# Altium project V9_BMU_REV43.PrjPcb (part 2 of 3)

## Sheet PG10_ MCU.SchDoc: BMU - MCU Circuit
size B; Address1: 3511 EDISON WAY; Address2: MENLO PARK, CA, 94025; DocumentNumber: 1; Revision: 4.1; SheetNumber: 5; SheetTotal: 9
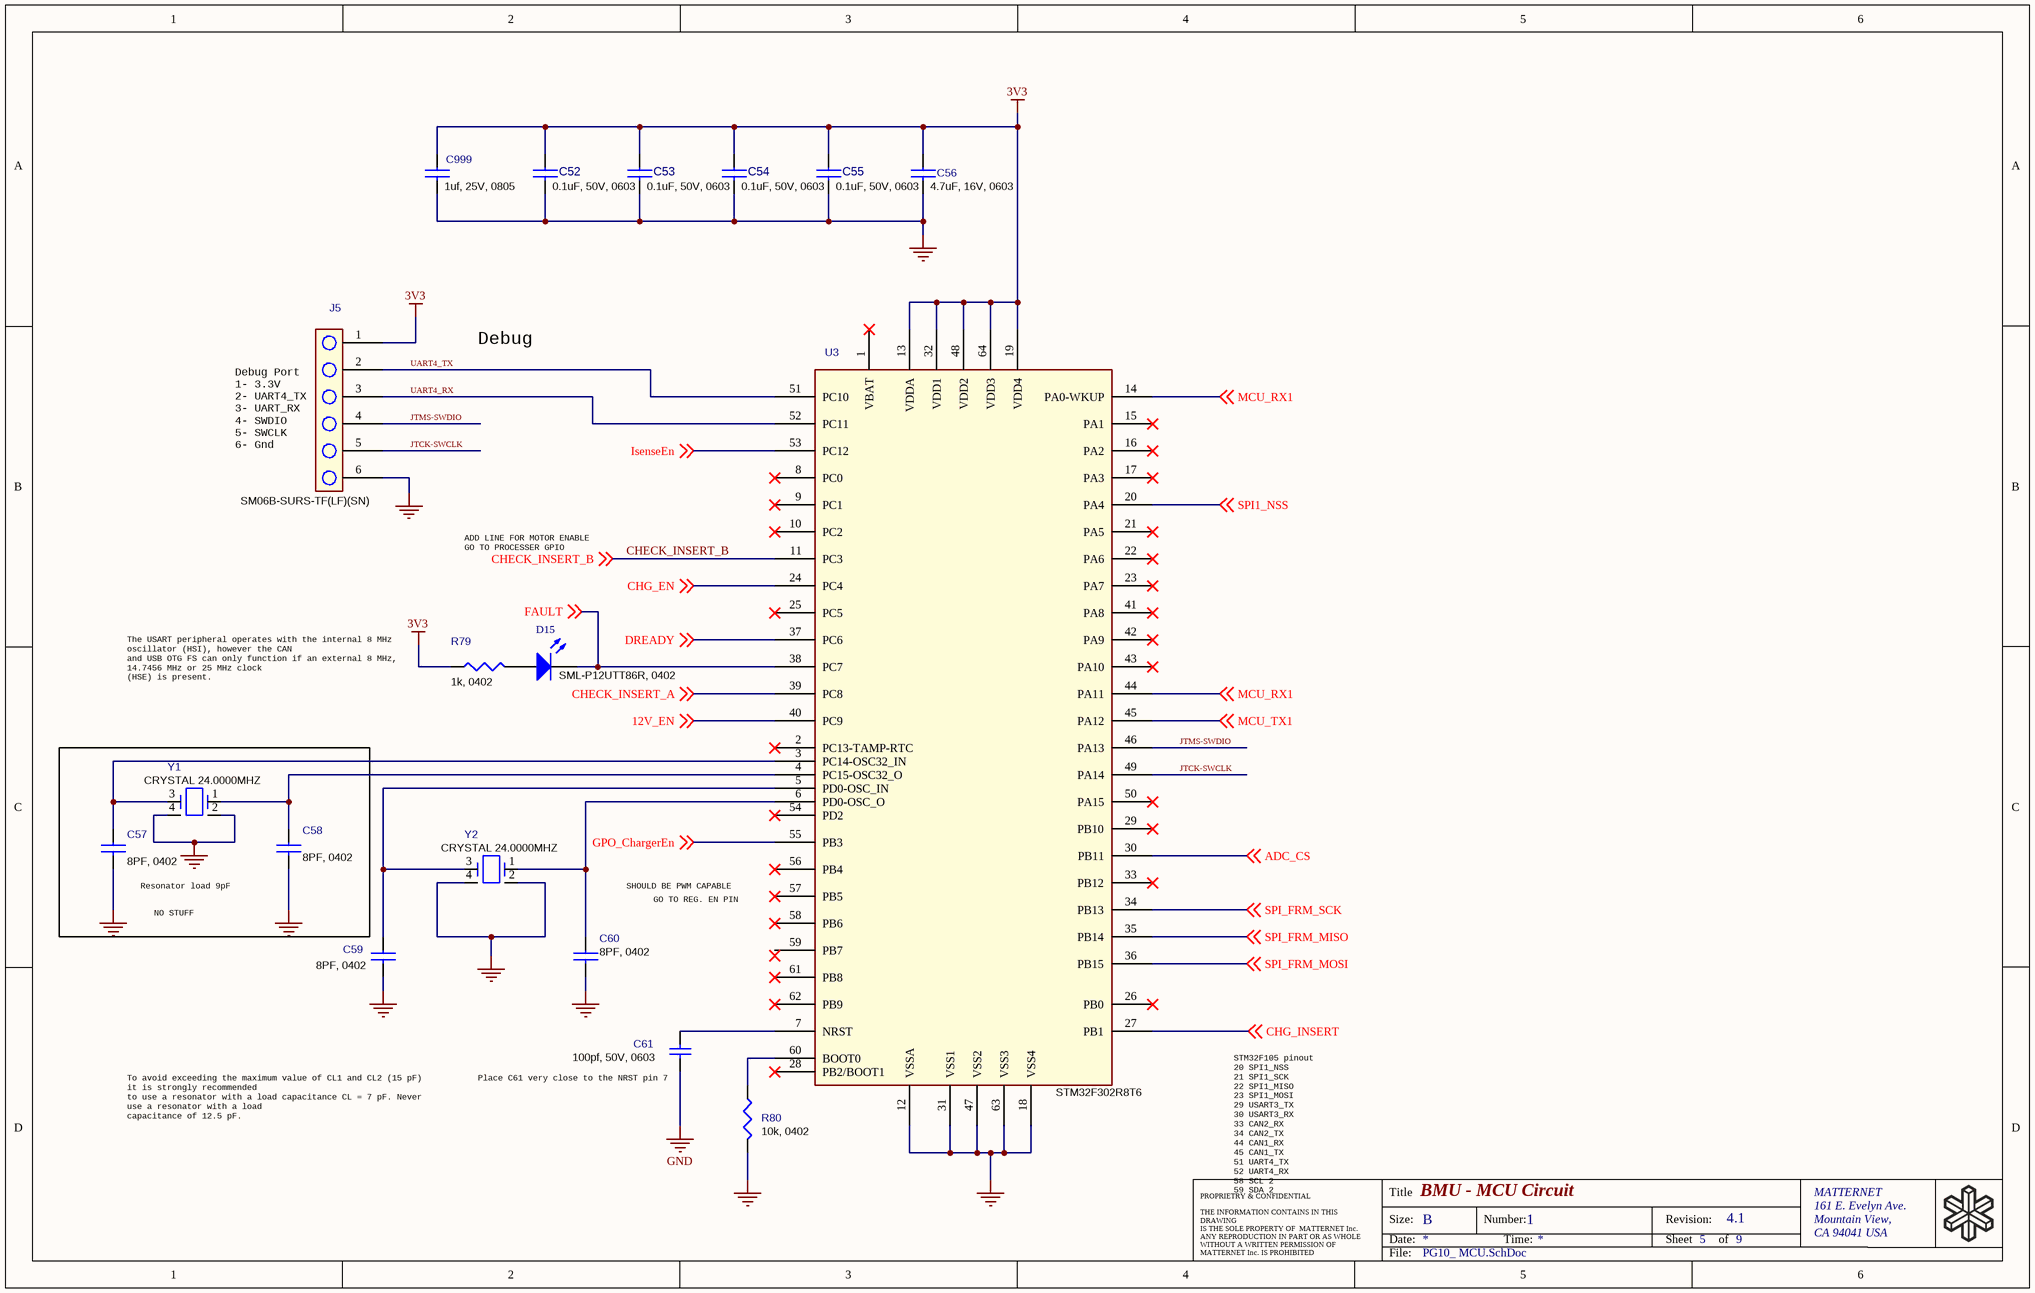
[diagram p4: PG10_ MCU.SchDoc]

### Parts
C52  0.1uF, 50V, 0603  [C0603]
C53  0.1uF, 50V, 0603  [C0603]
C54  0.1uF, 50V, 0603  [C0603]
C55  0.1uF, 50V, 0603  [C0603]
C56  4.7uF, 16V, 0603  [C0805]
C57  8PF, 0402  [C0402]
C58  8PF, 0402  [C0402]
C59  8PF, 0402  [C0402]
C60  8PF, 0402  [C0402]
C61  100pf, 50V, 0603  [C0603]
C999  1uf, 25V, 0805  [C0805]
D15  SML-P12UTT86R, 0402  [D0402_1]
J5  SM06B-SURS-TF(LF)(SN)  [0.8mm]
R79  1k, 0402  [R0402]
R80  10k, 0402  [R0402]
U3  STM32F302R8T6  [64LQFP]
Y1  CRYSTAL 24.0000MHZ  [CRYSTAL_NX3225SA]
Y2  CRYSTAL 24.0000MHZ  [CRYSTAL_NX3225SA]

### Nets
3V3: C52.1 C53.1 C54.1 C55.1 C56.1 C999.1 J5.1 R79.1 U3.13(VDDA) U3.19(VDD4) U3.32(VDD1) U3.48(VDD2) U3.64(VDD3)
GND: C52.2 C53.2 C54.2 C55.2 C56.2 C57.2 C58.2 C59.2 C60.2 C61.1 C999.2 J5.6 R80.2 U3.12(VSSA) U3.18(VSS4) U3.31(VSS1) U3.47(VSS2) U3.63(VSS3) Y1.2 Y1.4 Y2.2 Y2.4
12V_EN: U3.40(PC9) ; off-sheet 12V_EN
ADC_CS: U3.30(PB11) ; off-sheet ADC_CS
CHECK_INSERT_A: U3.39(PC8) ; off-sheet CHECK_INSERT_A
CHECK_INSERT_B: U3.11(PC3) ; off-sheet CHECK_INSERT_B
CHG_EN: U3.24(PC4) ; off-sheet CHG_EN
CHG_INSERT: U3.27(PB1) ; off-sheet CHG_INSERT
DREADY: U3.37(PC6) ; off-sheet DREADY
FAULT: D15.2(K) U3.38(PC7) ; off-sheet FAULT
GPO_ChargerEn: U3.55(PB3) ; off-sheet GPO_ChargerEn
IsenseEn: U3.53(PC12) ; off-sheet IsenseEn
JTCK-SWCLK: J5.5 U3.49(PA14)
JTMS-SWDIO: J5.4 U3.46(PA13)
MCU_RX1: U3.14(PA0-WKUP) U3.44(PA11) ; off-sheet MCU_RX1
MCU_TX1: U3.45(PA12) ; off-sheet MCU_TX1
SPI1_NSS: U3.20(PA4) ; off-sheet SPI1_NSS
SPI_FRM_MISO: U3.35(PB14) ; off-sheet SPI_FRM_MISO
SPI_FRM_MOSI: U3.36(PB15) ; off-sheet SPI_FRM_MOSI
SPI_FRM_SCK: U3.34(PB13) ; off-sheet SPI_FRM_SCK
UART4_RX: J5.3 U3.52(PC11)
UART4_TX: J5.2 U3.51(PC10)
NetC57_1: C57.1 U3.3(PC14-OSC32_IN) Y1.3
NetC58_1: C58.1 U3.4(PC15-OSC32_O) Y1.1
NetC59_1: C59.1 U3.5(PD0-OSC_IN) Y2.3
NetC60_1: C60.1 U3.6(PD0-OSC_O) Y2.1
NetC61_2: C61.2 U3.7(NRST)
NetR80_1: R80.1 U3.60(BOOT0)

Not connected (* = marked no-connect by the designer): D15 1(A); R79 2; U3 1(VBAT)* 2(PC13-TAMP-RTC)* 8(PC0)* 9(PC1)* 10(PC2)* 15(PA1)* 16(PA2)* 17(PA3)* 21(PA5)* 22(PA6)* 23(PA7)* 25(PC5)* 26(PB0)* 28(PB2/BOOT1)* 29(PB10)* 33(PB12)* 41(PA8)* 42(PA9)* 43(PA10)* 50(PA15)* 54(PD2)* 56(PB4)* 57(PB5)* 58(PB6)* 59(PB7) 61(PB8)* 62(PB9)*

### Notes on the sheet
- Debug
- (near J5) Debug Port
  1- 3.3V
  2- UART4_TX
  3- UART_RX
  4- SWDIO
  5- SWCLK
  6- Gnd
- ADD LINE FOR MOTOR ENABLE
  GO TO PROCESSER GPIO
- (near R79) The USART peripheral operates with the internal 8 MHz
  oscillator (HSI), however the CAN
  and USB OTG FS can only function if an external 8 MHz,
  14.7456 MHz or 25 MHz clock
  (HSE) is present.
- (near C57) Resonator load 9pF
- SHOULD BE PWM CAPABLE
- GO TO REG. EN PIN
- NO STUFF
- (near C61) Place C61 very close to the NRST pin 7
- To avoid exceeding the maximum value of CL1 and CL2 (15 pF)
  it is strongly recommended
  to use a resonator with a load capacitance CL = 7 pF. Never
  use a resonator with a load
  capacitance of 12.5 pF.
- STM32F105 pinout
  20 SPI1_NSS
  21 SPI1_SCK
  22 SPI1_MISO
  23 SPI1_MOSI
  29 USART3_TX
  30 USART3_RX
  33 CAN2_RX
  34 CAN2_TX
  44 CAN1_RX
  45 CAN1_TX
  51 UART4_TX
  52 UART4_RX
  58 SCL 2
  59 SDA 2
- Title
- Size:
- Date:
- B
- Number:
- Time:
- Revision:
- Sheet
- of
- MATTERNET
- 161 E. Evelyn Ave.
- Mountain View,
- CA 94041 USA
- PROPRIETRY & CONFIDENTIAL
  THE INFORMATION CONTAINS IN THIS DRAWING
  IS THE SOLE PROPERTY OF  MATTERNET Inc.
  ANY REPRODUCTION IN PART OR AS WHOLE
  WITHOUT A WRITTEN PERMISSION OF
  MATTERNET Inc. IS PROHIBITED
- File:

### Library data of the parts
C52-C55 = CAP-Generic-0603: CAP CER 0.1UF 50V 10% X7R 0603; Manufacturer: Murata; Manufacturer Part Number: GCJ188R71E104KA12D; Supplier 1: Digi-Key; Supplier Part Number 1: 490-16477-1-ND; Stock 1: 2560; Pricing 1: 1=0.22, 10=0.152, 100=0.077, 500=0.0527, 1000=0.04662 (USD); Case/Package: 0603; Supplier 2: Mouser; Supplier Part Number 2: 81-GCJ188R71E104KA2D; Stock 2: 47905; Pricing 2: 1=0.21, 10=0.139, 50=0.139, 100=0.071, 1000=0.043, 10000=0.035 (USD)
C56 = CAP-Generic-0603: CAP CER 4.7UF 16V 10% X7R 0805; Manufacturer: TDK; Manufacturer Part Number: CGA4J3X7R1C475K125AE; Supplier 1: Digi-Key; Supplier Part Number 1: 445-8788-1-ND; Stock 1: 255080; Pricing 1: 1=0.7, 10=0.498, 100=0.3279, 500=0.24288, 1000=0.20645 (USD); Mount: Surface Mount; Case/Package: 0805; Weight: 0.000194oz; Case Code (Imperial): 0805; Case Code (Metric): 2012; Min Operating Temperature: -55°C; Max Operating Temperature: 125°C; Capacitance: 4.7uF; Tolerance: 10%; Packaging: Tape and Reel; Voltage Rating: 16V; Termination: SMD/SMT; Voltage Rating (DC): 16V; Package Quantity: 1; Dielectric: X7R; Features: Soft Termination; Length: 2mm; Height: 1.25mm; Width: 1.2mm; Thickness: 0.057inch; Depth: 1.25mm; Ratings: AEC-Q200; REACH SVHC: No SVHC; ComponentLink1URL: http://www.mouser.com/ds/2/400/lcc_commercial_soft_en-775842.pdf?src-supplier=Mouser; ComponentLink1Description: http://www.mouser.com/ds/2/400/lcc_commercial_soft_en-775842.pdf?src-supplier=Mouser; ComponentLink2URL: http://www.farnell.com/datasheets/1863333.pdf?src-supplier=Element14; ComponentLink2Description: http://www.farnell.com/datasheets/1863333.pdf?src-supplier=Element14; Supplier 2: Mouser; Supplier Part Number 2: 810-CGA4J3X7R1C475KS; Stock 2: 3160; Pricing 2: 1=0.7, 10=0.498, 50=0.498, 100=0.328, 1000=0.207, 10000=0.176 (USD)
C57-C60 = CAP-Generic-0402: CAP CER 8PF 50V C0G 0402; Manufacturer: TDK; Manufacturer Part Number: CGA2B2C0G1H080D050BA; ComponentLink1URL: http://www.mouser.com/ds/2/400/lcc_commercial_general_en-837201.pdf; ComponentLink1Description: http://www.mouser.com/ds/2/400/lcc_commercial_general_en-837201.pdf; ComponentLink2URL: https://product.tdk.com/info/en/documents/chara_sheet/C1005C0G1H080C050BA.pdf; ComponentLink2Description: https://product.tdk.com/info/en/documents/chara_sheet/C1005C0G1H080C050BA.pdf; Supplier 1: Digi-Key; Supplier Part Number 1: 445-5582-1-ND; Stock 1: 4049; Pricing 1: 1=0.1, 10=0.076, 100=0.0338, 500=0.02416, 1000=0.01898, 2500=0.01725, 5000=0.01587 (USD); Mount: Surface Mount; Case/Package: 0402; Weight: 2.3E-05oz; Case Code (Imperial): 0402; Case Code (Metric): 1005; Min Operating Temperature: -55°C; Max Operating Temperature: 125°C; Capacitance: 8pF; Voltage Rating: 50V; Voltage Rating (DC): 50V; Packaging: Tape and Reel; Dielectric: C0G; Termination: SMD/SMT; Package Quantity: 10000; Composition: Ceramic; Length: 1mm; Height: 0.5mm; Width: 0.5mm; Thickness: 0.022inch; Depth: 0.5mm; Ratings: AEC-Q200; REACH SVHC: No SVHC; ComponentLink3URL: http://www.mouser.com/ds/2/400/lcc_automotive_general_en-843974.pdf; ComponentLink3Description: http://www.mouser.com/ds/2/400/lcc_automotive_general_en-843974.pdf; ComponentLink4URL: http://www.farnell.com/datasheets/1807242.pdf; ComponentLink4Description: http://www.farnell.com/datasheets/1807242.pdf
C61 = Cap: CAP CER 100PF 50V NP0 0603; Manufacturer: TDK; Manufacturer Part Number: CGA3E2C0G1H101J080AE; Tolerance: 5%; Supplier 1: Digi-Key; Supplier Part Number 1: 445-173653-1-ND; Stock 1: 2011; Pricing 1: 1=0.27, 10=0.186, 100=0.0944, 500=0.06458, 1000=0.05713 (USD); Mount: Surface Mount; Case/Package: 0603; Case Code (Metric): 1608; Case Code (Imperial): 0603; Min Operating Temperature: -55°C; Max Operating Temperature: 125°C; Packaging: Tape and Reel; Capacitance: 100pF; Voltage Rating: 50V; Features: Soft Termination; Length: 0.063inch; Width: 0.031inch; Thickness: 0.037inch; Ratings: AEC-Q200; Supplier 2: Mouser; Supplier Part Number 2: 810-CGA3E2C0G1H101JA; Stock 2: 41170; Pricing 2: 1=0.27, 10=0.186, 50=0.186, 100=0.095, 1000=0.058, 10000=0.044 (USD)
C999 = CAP-Generic-0402: CAP CER 1UF 25V X7R 0805; Manufacturer: Murata; Manufacturer Part Number: GCJ21BR71E105KA12L; Tolerance: 10%; Supplier 1: Digi-Key; Supplier Part Number 1: 490-5802-1-ND; Stock 1: 116649; Pricing 1: 1=0.48, 10=0.333, 100=0.1997, 500=0.14974, 1000=0.12645 (USD); Mount: Surface Mount; Case/Package: 0805; Case Code (Imperial): 0805; Case Code (Metric): 2012; Min Operating Temperature: -55°C; Max Operating Temperature: 125°C; Capacitance: 1uF; Voltage Rating: 25V; Voltage Rating (DC): 25V; Packaging: Tape and Reel; Package Quantity: 3000; Dielectric: X7R; Termination: SMD/SMT; Features: Soft Termination; Length: 2mm; Width: 1.25mm; Thickness: 0.057inch; Depth: 1.25mm; Ratings: AEC-Q200; Lead Free: Lead Free
D15 = LED0: LED Uni-Color Red Chip LED 2-Pin 0402 T/R; Manufacturer: Rohm; Manufacturer Part Number: SML-P12U2TT86R; Lens Color: Colorless; Lens Transparency: Clear; Luminous Intensity: 70mcd; Test Current: 20mA; Dominant Wavelength: 615nm; Forward Voltage: 2V; Supplier 1: Digi-Key; Supplier Part Number 1: 846-1192-1-ND; Stock 1: 9518; Pricing 1: 1=0.45, 10=0.327, 25=0.2504, 100=0.1634, 250=0.1198, 500=0.10164, 1000=0.08349, 2500=0.0726 (USD); Mount: Surface Mount; Case/Package: 0402; Color: Red; Case Code (Metric): 1006; Case Code (Imperial): 0402; Packaging: Cut Tape; Length: 1mm; Height: 0.25mm; Width: 0.6mm; Lead Free: Lead Free; Supplier 2: Mouser; Supplier Part Number 2: 755-SML-P12U2TT86R; Stock 2: 13361; Pricing 2: 1=0.37, 10=0.238, 50=0.238, 100=0.102, 1000=0.079, 10000=0.06 (USD)
J5 = CONN-GENERIC-1X6: Headers & Wire Housings 6P SR UNSHRD HRD TIN OVER NI; Manufacturer: JST; custprt: 100-0410-000212; custinv: Ansync; Option: A; Number of Positions: 6; Connector Type: Outer Shroud Contact; Pitch: 0.031inch; Supplier 1: Digi-Key; Supplier Part Number 1: SM06B-SURS-TF(LF)(SN)-ND; Manufacturer Part Number: SM06B-SURS-TF(LF)(SN); Stock 1: 0; Pricing 1: 3500=0.43193 (USD); Mount: Surface Mount; Colour: Natural; Contact Plating: Tin; Number of Rows: 1; Packaging: Tape and Reel; Termination: Solder; ComponentLink1URL: http://www.jst-mfg.com/product/pdf/eng/eSUR.pdf; ComponentLink1Description: http://www.jst-mfg.com/product/pdf/eng/eSUR.pdf
R79 = R-Generic-0402: RES SMD 1K OHM 5% 1/16W 0402; Manufacturer: Yageo; Manufacturer Part Number: RC0402JR-071KL; custinv: Ansync; custprt: 100-0120-000074; Option: AB; Resistance: 1kR; Power Rating: 62.5mW; Voltage Rating: 50V; Temperature Coefficient: 100ppm/°C; Max Power Dissipation: 63mW; Supplier 1: Digi-Key; Supplier Part Number 1: 311-1.0KJRCT-ND; Stock 1: 18546768; Pricing 1: 1=0.1, 10=0.015, 100=0.006, 1000=0.00268, 2500=0.00233, 5000=0.00192 (USD); Case/Package: 0402; Case Code (Imperial): 0402; Case Code (Metric): 1005; Min Operating Temperature: -55°C; Max Operating Temperature: 155°C; Tolerance: 5%; Packaging: Tape and Reel; Package Quantity: 1; Termination: SMD/SMT; Composition: Thick Film; Number of Terminations: 2; Military Standard: Not; Features: Moisture Resistant; Length: 0.039inch; Height: 0.016inch; Width: 0.02inch; Depth: 0.5mm; REACH SVHC: No SVHC; Lead Free: Lead Free; ComponentLink1URL: http://www.yageo.com/documents/recent/PYu-RC_Group_51_RoHS_L_9.pdf; ComponentLink1Description: http://www.yageo.com/documents/recent/PYu-RC_Group_51_RoHS_L_9.pdf; ComponentLink2URL: http://www.farnell.com/datasheets/1018594.pdf; ComponentLink2Description: http://www.farnell.com/datasheets/1018594.pdf; ComponentLink3URL: http://www.yageo.com/documents/recent/PYu-RC0402_51_RoHS_L_6_r.pdf; ComponentLink3Description: http://www.yageo.com/documents/recent/PYu-RC0402_51_RoHS_L_6_r.pdf
R80 = R-Generic-0402: RES SMD 10K OHM 1% 1/16W 0402; Manufacturer: Vishay Dale; Manufacturer Part Number: CRCW040210K0FKTD; Resistance: 10kR; Power Rating: 63mW; Voltage Rating: 50V; Temperature Coefficient: 100ppm/°C; ComponentLink1URL: http://www.yageo.com/documents/recent/PYu-RC_Group_51_RoHS_L_9.pdf; ComponentLink1Description: http://www.yageo.com/documents/recent/PYu-RC_Group_51_RoHS_L_9.pdf; ComponentLink2URL: http://www.mouser.com/ds/2/447/PYu-RC0402_51_RoHS_L_6_r-8721.pdf; ComponentLink2Description: http://www.mouser.com/ds/2/447/PYu-RC0402_51_RoHS_L_6_r-8721.pdf; ComponentLink3URL: http://www.farnell.com/datasheets/1018594.pdf; ComponentLink3Description: http://www.farnell.com/datasheets/1018594.pdf; Supplier 1: Digi-Key; Supplier Part Number 1: 541-2955-1-ND; Stock 1: 17223; Pricing 1: 1=0.15, 10=0.132, 100=0.0508, 1000=0.02236, 2500=0.01931, 5000=0.01728 (USD); Mount: Surface Mount; Case/Package: 0402; Number of Pins: 2; Weight: 2.3E-05oz; Case Code (Metric): 1005; Case Code (Imperial): 0402; Contact Plating: Lead,Tin; Min Operating Temperature: -55°C; Max Operating Temperature: 155°C; Tolerance: 1%; Packaging: Tape and Reel; Package Quantity: 10000; Composition: Thick Film; Number of Terminations: 2; Military Standard: Not; Max Power Dissipation: 63mW; Voltage Rating (DC): 50V; Features: Automotive AEC-Q200; Length: 1mm; Height: 0.016inch; Width: 0.02inch; Depth: 0.5mm; Radiation Hardening: No; Lead Free: Contains Lead; REACH SVHC: Unknown; ComponentLink4URL: http://www.vishay.com/docs/20008/dcrcw.pdf?src-supplier=Digi-Key; ComponentLink4Description: http://www.vishay.com/docs/20008/dcrcw.pdf?src-supplier=Digi-Key; ComponentLink5URL: https://www.verical.com/server-webapp/html/getDatasheet?partID=104182&src-supplier=Verical; ComponentLink5Description: https://www.verical.com/server-webapp/html/getDatasheet?partID=104182&src-supplier=Verical; ComponentLink6URL: http://www.vishay.com/docs/20008/dcrcw.pdf?src-supplier=Avnet; ComponentLink6Description: http://www.vishay.com/docs/20008/dcrcw.pdf?src-supplier=Avnet
U3 = MCU-STM32F105RBT6-700-443: MCU 32-bit STM32 ARM Cortex M4 RISC 128KB Flash 2.5V/3.3V 64-Pin LQFP Tray; Manufacturer 1: STMicroelectronics; Manufacturer Part Number 1: STM32F302RBT6; Peripherals: POR,PWM,WDT,DMA; Interface: I2C,SPI,USB,CAN,I2S,UART,USART,IrDA,LIN; Number of I/Os: 27; Frequency: 72MHz; Oscillator Type: Internal; Number of USB Channels: 1; Number of SPI Channels: 3; Number of I2C Channels: 2; Number of PWM Channels: 6; Number of Programmable I/O: 52; Min Supply Voltage: 2V; Watchdog Timer: Yes; RAM Size: 32KB; Number of Timers/Counters: 8; Max Supply Voltage: 3.6V; Data Bus Width: 32b; ComponentLink1URL: http://www.st.com/web/en/resource/technical/document/datasheet/DM00094064.pdf; ComponentLink1Description: http://www.st.com/web/en/resource/technical/document/datasheet/DM00094064.pdf; ComponentLink2URL: http://www.farnell.com/datasheets/1824148.pdf; ComponentLink2Description: http://www.farnell.com/datasheets/1824148.pdf; ComponentLink3URL: https://datasheet.ciiva.com/12270/dm00058181-101707-12270628.pdf?src-supplier=Mouser; ComponentLink3Description: https://datasheet.ciiva.com/12270/dm00058181-101707-12270628.pdf?src-supplier=Mouser; ComponentLink4URL: https://datasheet.ciiva.com/22691/1880973-22691996.pdf?src-supplier=Element14; ComponentLink4Description: https://datasheet.ciiva.com/22691/1880973-22691996.pdf?src-supplier=Element14; ComponentLink5URL: https://datasheet.ciiva.com/29719/dm00094064-29719691.pdf?src-supplier=Digi-Key; ComponentLink5Description: https://datasheet.ciiva.com/29719/dm00094064-29719691.pdf?src-supplier=Digi-Key; Supplier 1: Digi-Key; Supplier Part Number 1: 497-17416-ND; RoHS: Yes; Category: Microcontrollers; Stock 1: 1015; Pricing 1: 1=4.79000, 10=4.30300, 25=4.06760, 100=3.52540, 250=3.34460, 500=3.00112, 1000=2.53106, 2500=2.40451, 5000=2.31411 (USD); Case/Package: LQFP; Number of Pins: 64; Contact Plating: Gold; Min Operating Temperature: -40°C; Max Operating Temperature: 85°C; Memory Type: FLASH; Memory Size: 128KB; Core Architecture: ARM; Packaging: Tray; Max Frequency: 72MHz; Number of UART Channels: 2; Number of ADC Channels: 1; Package Quantity: 960; Length: 10.2mm; Height: 1.45mm; Width: 10.2mm; Radiation Hardening: No; REACH SVHC: No SVHC; Lead Free: Lead Free
Y1 Y2 = CRY-Generic: CRYSTAL 24.0000MHZ 8PF SMD; Manufacturer: NDK; Manufacturer Part Number: NX3225SA-24.000MHZ-STD-CSR-1; custinv: Ansync; custprt: 100-0830-000044; Option: AB; Frequency: 24MHz; Frequency Tolerance: 15ppm; ESR (Equivalent Series Resistance): 50R; Supplier 1: Digi-Key; Supplier Part Number 1: 644-1052-1-ND; Stock 1: 48121; Pricing 1: 1=0.75, 10=0.663, 50=0.6196, 100=0.5476, 500=0.51876, 1000=0.4323 (USD); Mount: Surface Mount; Case/Package: SMD/SMT; Min Operating Temperature: -10°C; Max Operating Temperature: 75°C; Packaging: Tape and Reel; Load Capacitance: 8pF; Frequency Stability: 15ppm; Length: 0.126inch; Height: 0.028inch; Width: 0.098inch; Supplier 2: Mouser; Supplier Part Number 2: 344-NX3225SA24MCSR1; Stock 2: 5833; Pricing 2: 1=0.71, 10=0.587, 50=0.587, 100=0.519, 1000=0.41, 10000=0.335 (USD)

## Sheet PG11_ CAN_CONN.SchDoc: BMU - Battery Connector/CAN
size B; Address1: 3511 EDISON WAY; Address2: MENLO PARK, CA, 94025; DocumentNumber: 1; Revision: 4.1; SheetNumber: 6; SheetTotal: 9
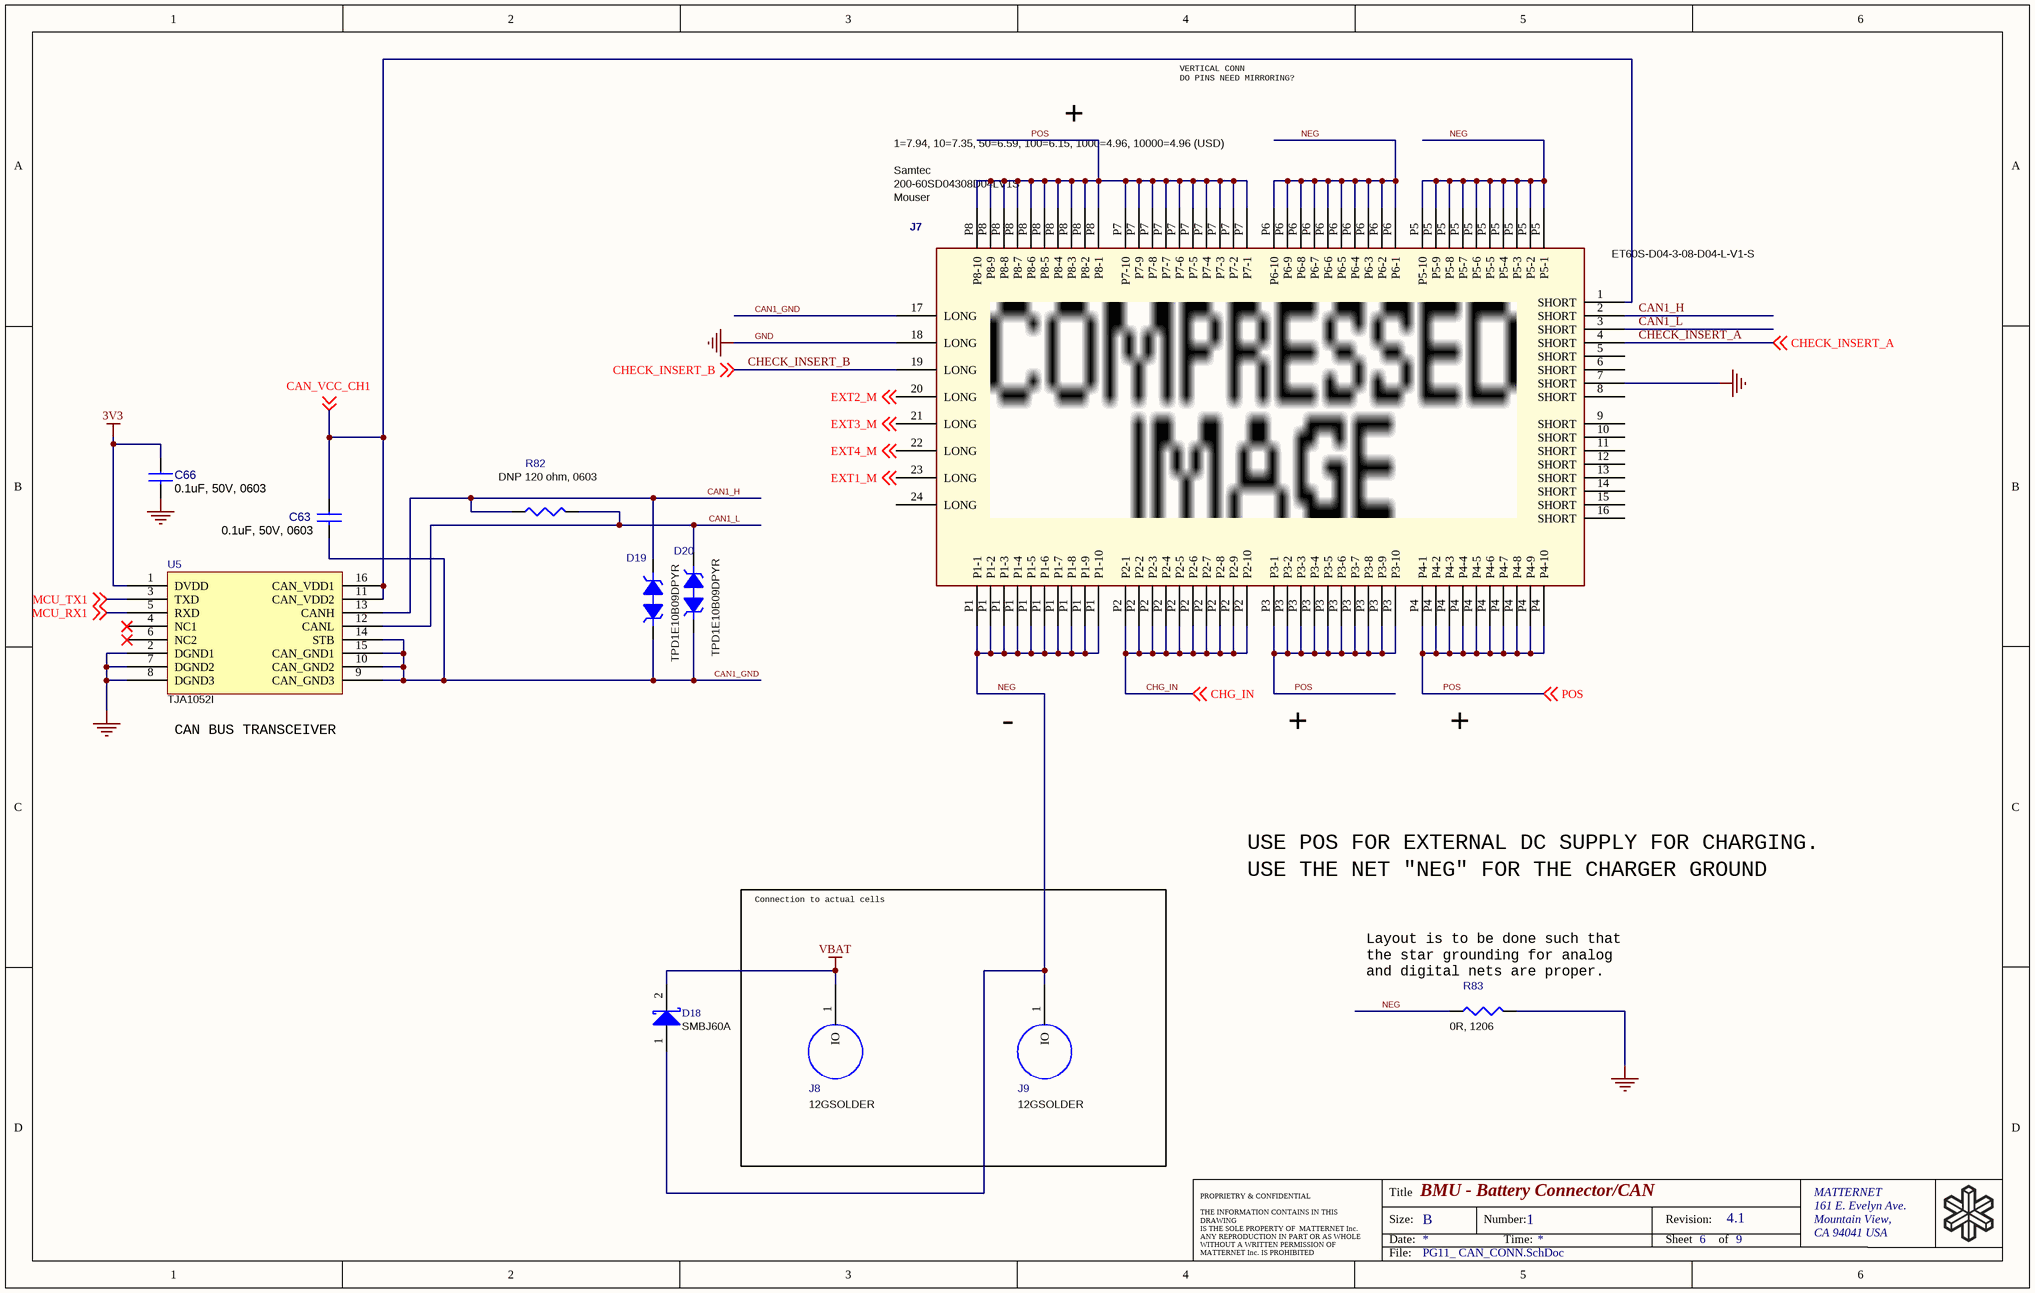
[diagram p5: PG11_ CAN_CONN.SchDoc]

### Parts
C63  0.1uF, 50V, 0603  [C0603]
C66  0.1uF, 50V, 0603  [C0603]
D18  SMBJ60A  [DO-214AA]
D19  TPD1E10B09DPYR  [2X2SON]
D20  TPD1E10B09DPYR  [2X2SON]
J7  ET60S-D04-3-08-D04-L-V1-S  Supplier 1: Mouser  Supplier Part Number 1: 200-60SD04308D04LV1S  Manufacturer: Samtec  Pricing 1: 1=7.94, 10=7.35, 50=6.59, 100=6.15, 1000=4.96, 10000=4.96 (USD)  [ET60S-D04-3-08-D04-L-V1-S]
J8  12GSOLDER  [12GPAD]  (no BOM)
J9  12GSOLDER  [12GPAD]  (no BOM)
R82  DNP 120 ohm, 0603  [R0603]  (no BOM)
R83  0R, 1206  [R1206]
U5  TJA1052I  [16-SOIC]

### Blocks framed on the sheet
Connection to actual cells: J8 J9

### Nets
3V3: C66.1 U5.1(DVDD)
GND: C66.2 J7.7(SHORT) J7.18(LONG) R83.1 U5.2(DGND1) U5.7(DGND2) U5.8(DGND3)
VBAT: D18.2(K) J8.1(IO)
CAN1_GND: C63.2 D19.1 D20.1 J7.17(LONG) U5.9(CAN_GND3) U5.10(CAN_GND2) U5.14(STB) U5.15(CAN_GND1)
CAN1_H: D19.2 J7.2(SHORT) R82.1 U5.13(CANH)
CAN1_L: D20.2 J7.3(SHORT) R82.2 U5.12(CANL)
CAN_VCC_CH1: C63.1 J7.1(SHORT) U5.11(CAN_VDD2) U5.16(CAN_VDD1) ; off-sheet CAN_VCC_CH1
CHECK_INSERT_A: J7.4(SHORT) ; off-sheet CHECK_INSERT_A
CHECK_INSERT_B: J7.19(LONG) ; off-sheet CHECK_INSERT_B
CHG_IN: J7.P2(P2-1) ; off-sheet CHG_IN
EXT1_M: J7.23(LONG) ; off-sheet EXT1_M
EXT2_M: J7.20(LONG) ; off-sheet EXT2_M
EXT3_M: J7.21(LONG) ; off-sheet EXT3_M
EXT4_M: J7.22(LONG) ; off-sheet EXT4_M
MCU_RX1: U5.5(RXD) ; off-sheet MCU_RX1
MCU_TX1: U5.3(TXD) ; off-sheet MCU_TX1
NEG: D18.1(A) J7.P1(P1-1) J7.P5(P5-1) J7.P6(P6-1) J9.1(IO) R83.2
POS: J7.P3(P3-1) J7.P4(P4-1) J7.P7(P7-1) J7.P8(P8-1) ; off-sheet POS

Not connected (* = marked no-connect by the designer): J7 5(SHORT) 6(SHORT) 8(SHORT) 9(SHORT) 10(SHORT) 11(SHORT) 12(SHORT) 13(SHORT) 14(SHORT) 15(SHORT) 16(SHORT) 24(LONG); U5 4(NC1)* 6(NC2)*

### Notes on the sheet
- +
- VERTICAL CONN
  DO PINS NEED MIRRORING?
- (near U5) CAN BUS TRANSCEIVER
- -
- USE POS FOR EXTERNAL DC SUPPLY FOR CHARGING.
- USE THE NET "NEG" FOR THE CHARGER GROUND
- (near R83) Layout is to be done such that the star grounding for analog and digital nets are proper.
- Title
- Size:
- Date:
- B
- Number:
- Time:
- Revision:
- Sheet
- of
- MATTERNET
- 161 E. Evelyn Ave.
- Mountain View,
- CA 94041 USA
- PROPRIETRY & CONFIDENTIAL
  THE INFORMATION CONTAINS IN THIS DRAWING
  IS THE SOLE PROPERTY OF  MATTERNET Inc.
  ANY REPRODUCTION IN PART OR AS WHOLE
  WITHOUT A WRITTEN PERMISSION OF
  MATTERNET Inc. IS PROHIBITED
- File:

### Library data of the parts
C63 C66 = CAP-Generic-0603: as C52 on sheet PG10_ MCU; Supplier 1: Digi-Key; Supplier Part Number 1: 490-16477-1-ND; Stock 1: 2560; Pricing 1: 1=0.22, 10=0.152, 100=0.077, 500=0.0527, 1000=0.04662 (USD); Case/Package: 0603; Supplier 2: Mouser; Supplier Part Number 2: 81-GCJ188R71E104KA2D; Stock 2: 47905; Pricing 2: 1=0.21, 10=0.139, 50=0.139, 100=0.071, 1000=0.043, 10000=0.035 (USD)
D18 = SMBJ60A: ESD Suppressors / TVS Diodes 60Vr; Manufacturer: Vishay Semiconductors; Manufacturer Part Number: SMBJ60A-E3/52; Clamping Voltage: 96.8V; Peak Pulse Power: 600W; Direction: Unidirectional; Reverse Standoff Voltage: 60V; Peak Pulse Current: 6.2A; Test Current: 1mA; Min Breakdown Voltage: 66.7V; Max Reverse Leakage Current: 1uA; Element Configuration: Single; Number of Elements: 1; Max Breakdown Voltage: 73.7V; ESD Protection: No; Supplier 1: Mouser; Supplier Part Number 1: 625-SMBJ60A-E3; Stock 1: 9885; Pricing 1: 1=0.52, 10=0.301, 50=0.301, 100=0.175, 1000=0.11, 10000=0.083 (USD); Mount: Surface Mount; Case/Package: SMB; Number of Pins: 2; Contact Plating: Matte,Tin; Min Operating Temperature: -55°C; Max Operating Temperature: 150°C; Packaging: Tape and Reel; Package Quantity: 750; Polarity: Unidirectional; Power Dissipation: 600W; Max Surge Current: 6.2A; Reverse Breakdown Voltage: 66.7V; Breakdown Voltage: 66.7V; Leakage Current: 1uA; Termination: SMD/SMT; Max Power Dissipation: 600W; Operating Supply Voltage: 60V; Number of Channels: 1; Length: 5.59mm; Height: 2.44mm; Width: 3.94mm; Radiation Hardening: No; Lead Free: Lead Free; ComponentLink1URL: http://media.digikey.com/pdf/Data%20Sheets/Vishay%20Semiconductors/SMBJ5.0A_thru_188A.pdf?src-supplier=Digi-Key; ComponentLink1Description: http://media.digikey.com/pdf/Data%20Sheets/Vishay%20Semiconductors/SMBJ5.0A_thru_188A.pdf?src-supplier=Digi-Key; ComponentLink2URL: http://www.vishay.com/docs/88392/smbj.pdf?src-supplier=Digi-Key; ComponentLink2Description: http://www.vishay.com/docs/88392/smbj.pdf?src-supplier=Digi-Key; ComponentLink3URL: https://www.verical.com/server-webapp/html/getDatasheet?partID=84761&src-supplier=Verical; ComponentLink3Description: https://www.verical.com/server-webapp/html/getDatasheet?partID=84761&src-supplier=Verical; ComponentLink4URL: http://components.arrow.com/part/dataview/42825922S9422245N5680?src-supplier=Arrow; ComponentLink4Description: http://components.arrow.com/part/dataview/42825922S9422245N5680?src-supplier=Arrow; Supplier 2: Digi-Key; Supplier Part Number 2: SMBJ60A-E3/52GIDKR-ND; Stock 2: 2980; Pricing 2: 1=0.37, 10=0.296, 25=0.2712, 100=0.2018, 250=0.18284 (USD)
D19 D20 = ESD BI-DIR TRIG 9VDC 0402_0: TVS DIODE 9VWM 20VC 2X2SON; Manufacturer: Texas Instruments; custinv: Ansync; custprt: 100-0500-000170; Option: AB; Direction: Bidirectional; Capacitance: 10pF; Number of Channels: 1; Reverse Standoff Voltage: 9V; Clamping Voltage: 20V; Peak Pulse Power: 90W; Power Line Protection: No; Breakdown Voltage: 9.5V; Leakage Current: 100nA; ESD Protection: Yes; Test Current: 1mA; Element Configuration: Single; Peak Pulse Current: 4.5A; TYPE: Diode; Supplier 1: Digi-Key; Supplier Part Number 1: 296-30405-1-ND; Manufacturer Part Number: TPD1E10B09DPYR; Stock 1: 89820; Pricing 1: 1=0.45, 10=0.336, 100=0.2096, 500=0.1434, 1000=0.11031 (USD); Case/Package: 0402; Number of Pins: 2; Contact Plating: Gold; Min Operating Temperature: -40°C; Max Operating Temperature: 125°C; Packaging: Tape and Reel; Package Quantity: 1; Number of Bidirectional Channels: 1; Min Breakdown Voltage: 9V; Working Voltage: 9V; Max Reverse Leakage Current: 100nA; Operating Supply Voltage: 9V; Composition: Zener; Length: 1.1mm; Height: 0.4mm; Width: 0.7mm; Radiation Hardening: No; REACH SVHC: No SVHC; Lead Free: Lead Free; ComponentLink1URL: http://www.ti.com/general/docs/lit/getliterature.tsp?genericPartNumber=TPD1E10B09&&fileType=pdf; ComponentLink1Description: http://www.ti.com/general/docs/lit/getliterature.tsp?genericPartNumber=TPD1E10B09&&fileType=pdf; ComponentLink2URL: http://www.ti.com/lit/ds/sllseb0b/sllseb0b.pdf; ComponentLink2Description: http://www.ti.com/lit/ds/sllseb0b/sllseb0b.pdf; ComponentLink3URL: http://www.ti.com/lit/ds/symlink/tpd1e10b09.pdf; ComponentLink3Description: http://www.ti.com/lit/ds/symlink/tpd1e10b09.pdf
J7 = ET60S-D04-3-08-D04-L-V1-S: EXtreme Ten60 Power Connector; custprt: ET60S-D04-3-08-D04-L-V1-S; custinv: Samtec; Manufacturer Part Number: ET60S-D04-3-08-D04-L-V1-S; Stock 1: 0; Supplier 2: Farnell; Supplier Part Number 2: 2731048; Stock 2: 0
J8 J9 = 12GSOLDER: Option: AB
R82 = R-Generic-0603: custprt: 100-0100-000119; custinv: Ansync; Option: C
R83 = R-Generic-1206: RES SMD 0 OHM JUMPER 1/4W 1206; Manufacturer: Yageo; Manufacturer Part Number: RC1206JR-070RL; custinv: Ansync; custprt: 100-0100-000016; Option: AB; Resistance: 0mR; Power Rating: 250mW; Tolerance: 5%; Voltage Rating: 200V; Temperature Coefficient: 200ppm/°C; Supplier 1: Digi-Key; Supplier Part Number 1: 311-0.0ERCT-ND; Stock 1: 4537898; Pricing 1: 1=0.1, 10=0.067, 25=0.0484, 50=0.0368, 100=0.0271, 250=0.02068, 500=0.01656, 1000=0.01218 (USD); Case/Package: 1206; Contact Plating: Matte,Tin; Case Code (Metric): 3216; Case Code (Imperial): 1206; Min Operating Temperature: -55°C; Max Operating Temperature: 155°C; Composition: Carbon Film,Thick Film; Packaging: Tape and Reel; Package Quantity: 5000; Number of Terminations: 2; Termination: SMD/SMT; Military Standard: Not; Max Power Dissipation: 250mW; Length: 3.1mm; Height: 0.026inch; Width: 0.063inch; Depth: 1.6mm; Radiation Hardening: No; REACH SVHC: Unknown; Lead Free: Lead Free; ComponentLink1URL: http://www.farnell.com/datasheets/1692832.pdf; ComponentLink1Description: http://www.farnell.com/datasheets/1692832.pdf; ComponentLink2URL: http://www.farnell.com/datasheets/444357.pdf; ComponentLink2Description: http://www.farnell.com/datasheets/444357.pdf; ComponentLink3URL: http://www.yageo.com/documents/recent/PYu-RC1206_51_RoHS_L-4.pdf; ComponentLink3Description: http://www.yageo.com/documents/recent/PYu-RC1206_51_RoHS_L-4.pdf; ComponentLink4URL: http://www.yageo.com/documents/recent/PYu-RC_Group_51_RoHS_L_9.pdf; ComponentLink4Description: http://www.yageo.com/documents/recent/PYu-RC_Group_51_RoHS_L_9.pdf; ComponentLink5URL: http://documents.rs-components.com/techlib://itc_doclist_GB.htm?stockno=6182243; ComponentLink5Description: http://documents.rs-components.com/techlib://itc_doclist_GB.htm?stockno=6182243; ComponentLink6URL: http://www.produktinfo.conrad.com/datenblaetter/400000-424999/402222-da-01-en-SMD_WIDERSTAND_0_OHM_1206.pdf; ComponentLink6Description: http://www.produktinfo.conrad.com/datenblaetter/400000-424999/402222-da-01-en-SMD_WIDERSTAND_0_OHM_1206.pdf
U5 = TJA1052I: CAN Bus, Transceiver SOIC; Manufacturer: NXP Semiconductors; Manufacturer Part Number: TJA1052IT/5Y; Max Supply Voltage: 5.25V; Number of Transmit Buffers: 1; Min Supply Voltage: 3V; Data Rate: 5Mbps; Number of Channels: 2; Channel Type: Unidirectional; Isolated Power: No; Supplier 1: Digi-Key; Supplier Part Number 1: 568-11942-1-ND; Stock 1: 1928; Pricing 1: 1=5.27, 10=4.732, 100=3.8768, 500=3.30026 (USD); Case/Package: SOIC; Number of Pins: 16; Min Operating Temperature: -40°C; Max Operating Temperature: 125°C; Number of Receive Buffers: 1; Packaging: Cut Tape; Interface: CAN; Number of Transceivers: 1; Radiation Hardening: No; REACH SVHC: No SVHC; ComponentLink1URL: http://www.farnell.com/datasheets/2045698.pdf; ComponentLink1Description: http://www.farnell.com/datasheets/2045698.pdf; ComponentLink2URL: http://www.nxp.com/documents/data_sheet/TJA1052I.pdf; ComponentLink2Description: http://www.nxp.com/documents/data_sheet/TJA1052I.pdf

## Sheet PG12_CURRENT_INTEGRATION.SchDoc: BMU - Current Monitor
size B; Address1: 3511 EDISON WAY; Address2: MENLO PARK, CA, 94025; DocumentNumber: 1; Revision: 4.1; SheetNumber: 7; SheetTotal: 9
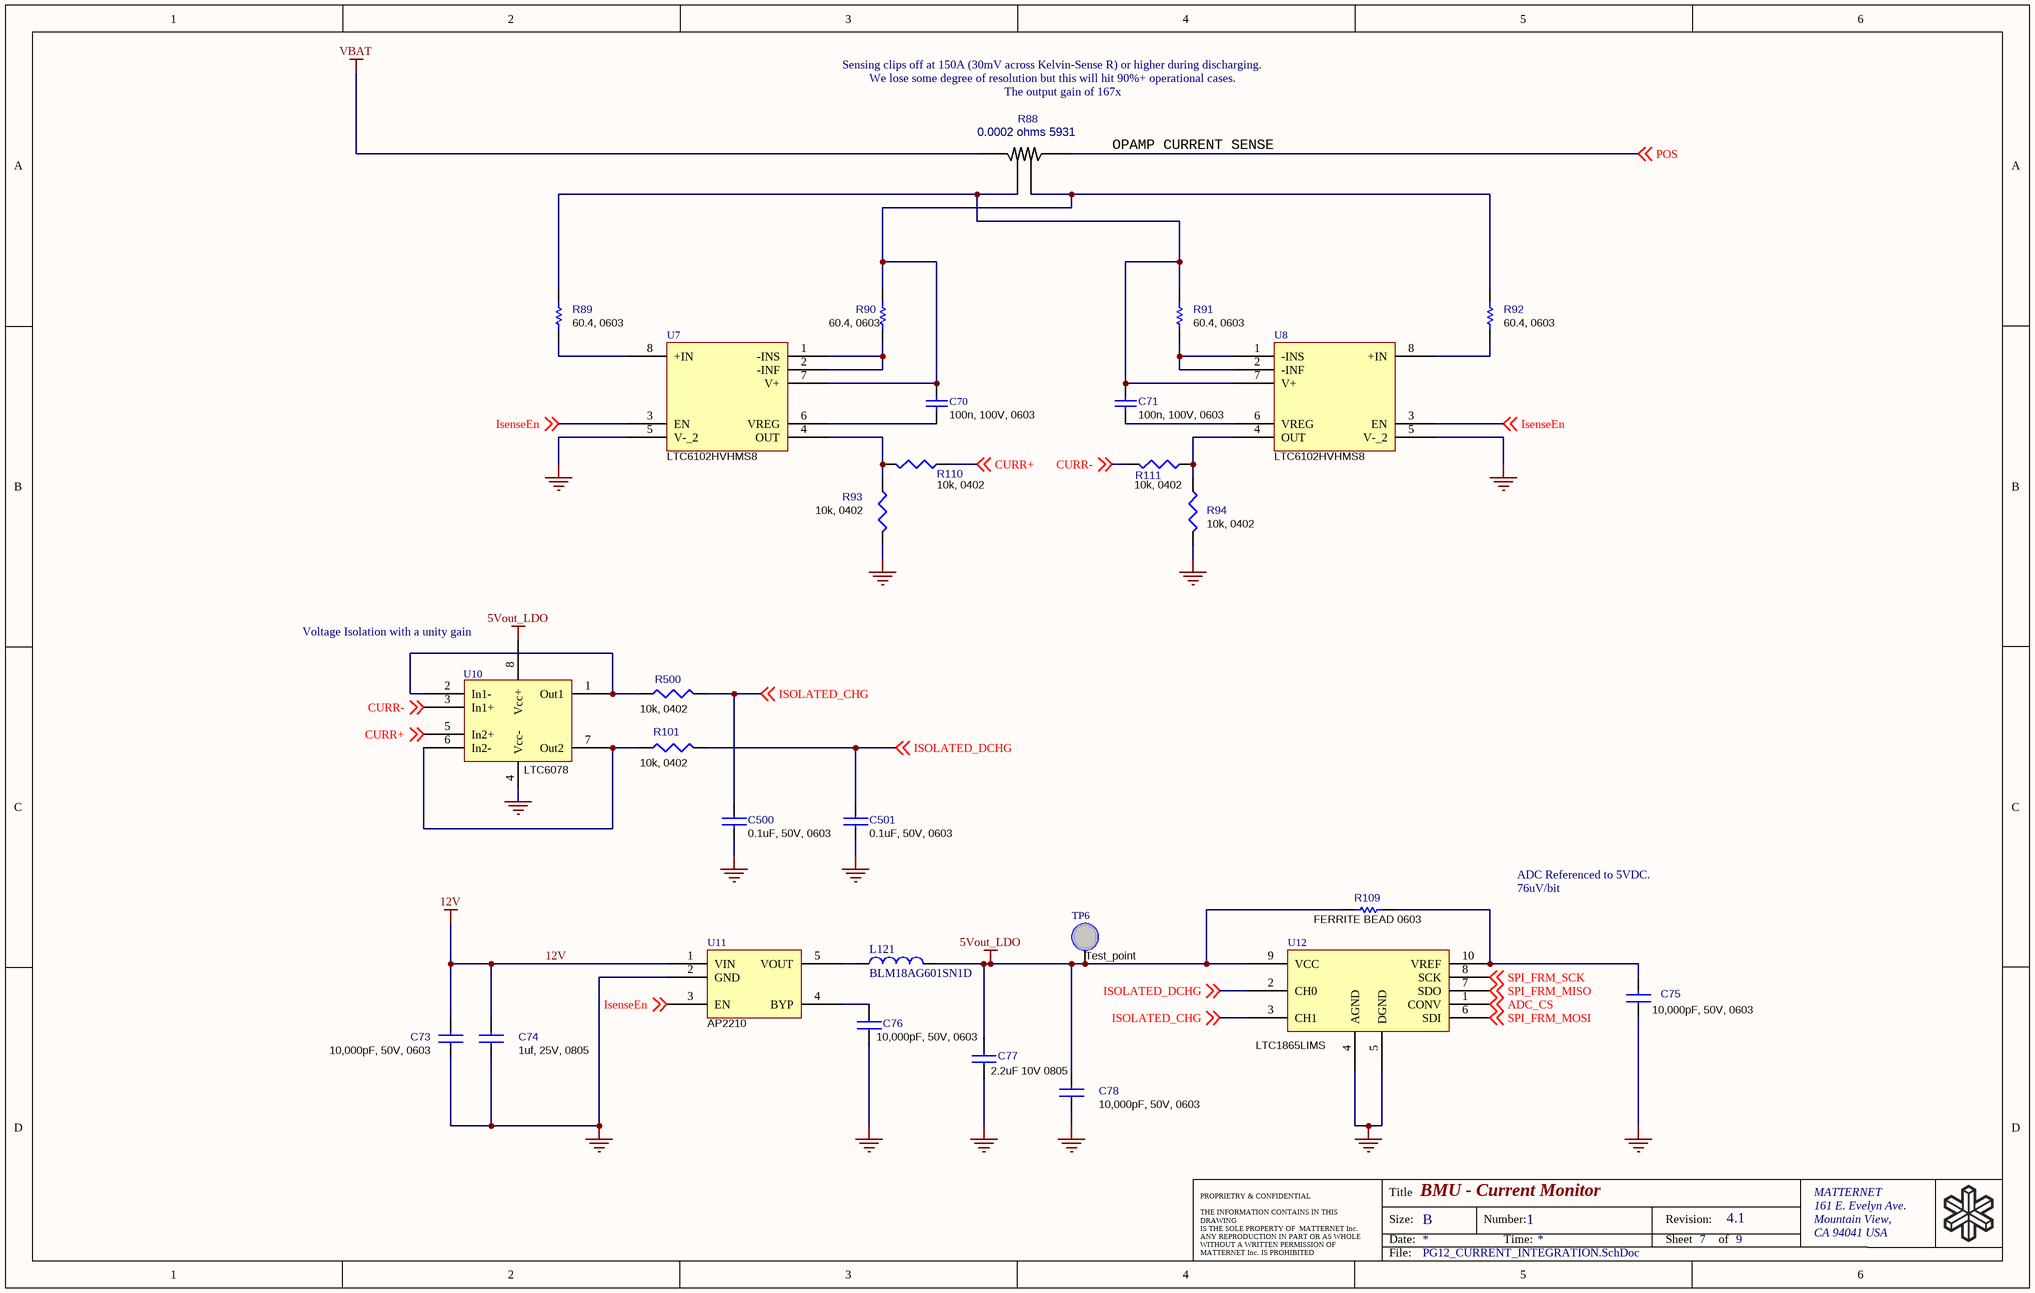
[diagram p6: PG12_CURRENT_INTEGRATION.SchDoc]

### Parts
C70  100n, 100V, 0603  [C0603]
C71  100n, 100V, 0603  [C0603]
C73  10,000pF, 50V, 0603  [C0603]
C74  1uf, 25V, 0805  [C0805]
C75  10,000pF, 50V, 0603  [C0603]
C76  10,000pF, 50V, 0603  [C0603]
C77  2.2uF 10V 0805  [C0805]
C78  10,000pF, 50V, 0603  [C0603]
C500  0.1uF, 50V, 0603  [C0603]
C501  0.1uF, 50V, 0603  [C0603]
L121  BLM18AG601SN1D  [INDC1608X10N]
R88  WSL2512R0700FEA  [R5931]  (value not drawn)
R89  60.4, 0603  [R0603]
R90  60.4, 0603  [R0603]
R91  60.4, 0603  [R0603]
R92  60.4, 0603  [R0603]
R93  10k, 0402  [R0402]
R94  10k, 0402  [R0402]
R101  10k, 0402  [R0402]
R109  FERRITE BEAD 0603  [R0603]
R110  10k, 0402  [R0402]
R111  10k, 0402  [R0402]
R500  10k, 0402  [R0402]
TP6  Test_point  [TP]  (no BOM)
U7  LTC6102HVHMS8  [8MSOP]
U8  LTC6102HVHMS8  [8MSOP]
U10  LTC6078  [8MSOP]
U11  AP2210  [SOT23-5]
U12  LTC1865LIMS  [10-MSOP]

### Nets
5Vout_LDO: C77.2 C78.2 L121.2 R109.2 TP6.1 U10.8(Vcc+) U12.9(VCC)
12V: C73.2 C74.2 U11.1(VIN)
GND: C73.1 C74.1 C75.1 C76.1 C77.1 C78.1 C500.2 C501.2 R93.2 R94.2 U7.5(V-_2) U8.5(V-_2) U10.4(Vcc-) U11.2(GND) U12.4(AGND) U12.5(DGND)
VBAT: R88.1
ADC_CS: U12.1(CONV) ; off-sheet ADC_CS
CURR+: R110.1 U10.5(In2+) ; off-sheet CURR+
CURR-: R111.2 U10.3(In1+) ; off-sheet CURR-
IsenseEn: U7.3(EN) U8.3(EN) U11.3(EN) ; off-sheet IsenseEn
ISOLATED_CHG: C500.1 R500.2 U12.3(CH1) ; off-sheet ISOLATED_CHG
ISOLATED_DCHG: C501.1 R101.2 U12.2(CH0) ; off-sheet ISOLATED_DCHG
POS: R88.2 ; off-sheet POS
SPI_FRM_MISO: U12.7(SDO) ; off-sheet SPI_FRM_MISO
SPI_FRM_MOSI: U12.6(SDI) ; off-sheet SPI_FRM_MOSI
SPI_FRM_SCK: U12.8(SCK) ; off-sheet SPI_FRM_SCK
NetC70_1: C70.1 U7.6(VREG)
NetC70_2: C70.2 R88.4 R90.2 R92.2 U7.7(V+)
NetC71_1: C71.1 U8.6(VREG)
NetC71_2: C71.2 R88.3 R89.2 R91.2 U8.7(V+)
NetC75_2: C75.2 R109.1 U12.10(VREF)
NetC76_2: C76.2 U11.4(BYP)
NetL121_1: L121.1 U11.5(VOUT)
NetR89_1: R89.1 U7.8(+IN)
NetR90_1: R90.1 U7.1(-INS) U7.2(-INF)
NetR91_1: R91.1 U8.1(-INS) U8.2(-INF)
NetR92_1: R92.1 U8.8(+IN)
NetR93_1: R93.1 R110.2 U7.4(OUT)
NetR94_1: R94.1 R111.1 U8.4(OUT)
NetR101_1: R101.1 U10.6(In2-) U10.7(Out2)
NetR500_1: R500.1 U10.1(Out1) U10.2(In1-)

### Notes on the sheet
- Sensing clips off at 150A (30mV across Kelvin-Sense R) or higher during discharging.
- We lose some degree of resolution but this will hit 90%+ operational cases.
- The output gain of 167x
- (near R88) 0.0002 ohms 5931
- OPAMP CURRENT SENSE
- (near U10) Voltage Isolation with a unity gain
- ADC Referenced to 5VDC.
- 76uV/bit
- Title
- Size:
- Date:
- B
- Number:
- Time:
- Revision:
- Sheet
- of
- MATTERNET
- 161 E. Evelyn Ave.
- Mountain View,
- CA 94041 USA
- PROPRIETRY & CONFIDENTIAL
  THE INFORMATION CONTAINS IN THIS DRAWING
  IS THE SOLE PROPERTY OF  MATTERNET Inc.
  ANY REPRODUCTION IN PART OR AS WHOLE
  WITHOUT A WRITTEN PERMISSION OF
  MATTERNET Inc. IS PROHIBITED
- File:

### Library data of the parts
C70 C71 = Cap: CAP CER 100n 100V X7R 0603; Manufacturer: Murata; Manufacturer Part Number: GCJ188R72A104KA01D; Capacitance: 100nF; Tolerance: 10%; Supplier 1: Digi-Key; Supplier Part Number 1: 490-13420-1-ND; Stock 1: 224293; Pricing 1: 1=0.28, 10=0.189, 100=0.1073, 500=0.07578, 1000=0.0663 (USD); Mount: Surface Mount; Case/Package: 0603; Case Code (Metric): 1608; Case Code (Imperial): 0603; Min Operating Temperature: -55°C; Max Operating Temperature: 125°C; Packaging: Tape and Reel; Voltage Rating: 100V; Features: Soft Termination; Length: 0.063inch; Width: 0.031inch; Thickness: 0.035inch; Ratings: AEC-Q200; Lead Free: Lead Free; Supplier 2: Mouser; Supplier Part Number 2: 81-GCJ188R72A104KA1D; Stock 2: 680575; Pricing 2: 1=0.26, 10=0.173, 50=0.173, 100=0.099, 1000=0.061, 10000=0.05 (USD)
C73 C75 C76 C78 = CAP-Generic-0603: CAP CER 10000PF 50V X7R 0603; Manufacturer: TDK; Manufacturer Part Number: CGA3E2X7R1H103K080AE; Capacitance: 10nF; Tolerance: 10%; Supplier 1: Digi-Key; Supplier Part Number 1: 445-15955-1-ND; Stock 1: 42633; Pricing 1: 1=0.27, 10=0.186, 100=0.0944, 500=0.06458, 1000=0.05713 (USD); Mount: Surface Mount; Case/Package: 0603; Weight: 7.1E-05oz; Case Code (Metric): 1608; Case Code (Imperial): 0603; Min Operating Temperature: -55°C; Max Operating Temperature: 125°C; Package Quantity: 4000; Packaging: Tape and Reel; Voltage Rating: 50V; Dielectric: X7R; Termination: SMD/SMT; Voltage Rating (DC): 50V; Features: Soft Termination; Length: 0.063inch; Height: 0.8mm; Width: 0.031inch; Thickness: 0.035inch; Ratings: AEC-Q200
C74 = CAP-Generic-0402: as C999 on sheet PG10_ MCU; Supplier 1: Digi-Key; Supplier Part Number 1: 490-5802-1-ND; Stock 1: 116649; Pricing 1: 1=0.48, 10=0.333, 100=0.1997, 500=0.14974, 1000=0.12645 (USD); Mount: Surface Mount; Case/Package: 0805; Case Code (Imperial): 0805; Case Code (Metric): 2012; Min Operating Temperature: -55°C; Max Operating Temperature: 125°C; Capacitance: 1uF; Voltage Rating: 25V; Voltage Rating (DC): 25V; Packaging: Tape and Reel; Package Quantity: 3000; Dielectric: X7R; Termination: SMD/SMT; Features: Soft Termination; Length: 2mm; Width: 1.25mm; Thickness: 0.057inch; Depth: 1.25mm; Ratings: AEC-Q200; Lead Free: Lead Free
C77 = CAP-Generic-0805: CAP CER 2.2UF 10V 10% X7R 0805; Manufacturer: KEMET; Manufacturer Part Number: C0805X225K8RACAUTO; Dielectric Material: Ceramic; Supplier 1: Digi-Key; Supplier Part Number 1: 399-11602-1-ND; Stock 1: 2328; Pricing 1: 1=0.9, 10=0.667, 100=0.4571, 500=0.36184, 1000=0.3047 (USD); Mount: Surface Mount; Case/Package: 0805; Case Code (Metric): 2012; Case Code (Imperial): 0805; Min Operating Temperature: -55°C; Max Operating Temperature: 125°C; Packaging: Tape and Reel; Capacitance: 2.2uF; Voltage Rating: 10V; Tolerance: 10%; Voltage Rating (DC): 10V; Dielectric: X7R; Features: Soft Termination; Length: 0.079inch; Width: 0.049inch; Thickness: 0.055inch; Ratings: AEC-Q200; Supplier 2: Mouser; Supplier Part Number 2: 80-C0805X225K8RAUTO; Stock 2: 4965; Pricing 2: 1=1.06, 10=0.715, 50=0.715, 100=0.446, 1000=0.369, 10000=0.228 (USD)
C500 C501 = CAP-Generic-0603: as C52 on sheet PG10_ MCU; Supplier 1: Digi-Key; Supplier Part Number 1: 490-16477-1-ND; Stock 1: 2560; Pricing 1: 1=0.22, 10=0.152, 100=0.077, 500=0.0527, 1000=0.04662 (USD); Case/Package: 0603; Supplier 2: Mouser; Supplier Part Number 2: 81-GCJ188R71E104KA2D; Stock 2: 47905; Pricing 2: 1=0.21, 10=0.139, 50=0.139, 100=0.071, 1000=0.043, 10000=0.035 (USD)
L121 = BLM18AG601SN1D: FERRITE BEAD 600 OHM 0603 1LN; ComponentLink1Description: Reference Spec; ComponentLink1URL: https://www.murata.com/en-us/products/productdata/8796738650142/ENFA0003.pdf; Supplier 1: Digi-Key; Supplier 2: Digi-Key; Supplier 3: Mouser; Supplier Part Number 1: 490-1014-1-ND; Supplier Part Number 2: 490-1014-2-ND; Supplier Part Number 3: 81-BLM11A601S
R88 = Res_4Term: RES SMD 200 UOHM 1% 5W 5931; Manufacturer: Vishay Dale; Manufacturer Part Number: WSL5931L2000FEA; Resistance: 0.2mR; Temperature Coefficient: 225ppm/°C; ComponentLink1URL: http://www.farnell.com/datasheets/1678796.pdf; ComponentLink1Description: http://www.farnell.com/datasheets/1678796.pdf; ComponentLink2URL: http://industrial.panasonic.com/www-data/pdf/AOA0000/AOA0000CE1.pdf; ComponentLink2Description: http://industrial.panasonic.com/www-data/pdf/AOA0000/AOA0000CE1.pdf; ComponentLink3URL: http://www.mouser.com/ds/2/315/AOA0000C84-947596.pdf; ComponentLink3Description: http://www.mouser.com/ds/2/315/AOA0000C84-947596.pdf; ComponentLink4URL: https://www.alliedelec.com/m/d/51cd0790071e1666bdb9d00c57fcf960.pdf; ComponentLink4Description: https://www.alliedelec.com/m/d/51cd0790071e1666bdb9d00c57fcf960.pdf; Supplier 1: Digi-Key; Supplier Part Number 1: WSLN-.0002CT-ND; Stock 1: 8569; Pricing 1: 1=2.69, 10=2.382, 25=2.2088, 50=2.079, 100=1.8191, 250=1.55924, 500=1.29938 (USD); Case/Package: 5931; Case Code (Imperial): 5931; Min Operating Temperature: -65°C; Max Operating Temperature: 170°C; Tolerance: 1%; Power Rating: 5W; Package Quantity: 1; Packaging: Tape and Reel; Composition: Metal Element,Metal Strip; Number of Terminations: 2; Termination: SMD/SMT; Max Power Dissipation: 5W; Features: Moisture Resistant; Length: 0.591inch; Height: 0.02inch; Width: 0.305inch; REACH SVHC: Unknown; ComponentLink5URL: http://www.vishay.com/docs/30110/wsl3921.pdf; ComponentLink5Description: http://www.vishay.com/docs/30110/wsl3921.pdf; Supplier 2: Mouser; Supplier Part Number 2: 71-WSL5931L2000FEA; Stock 2: 2674; Pricing 2: 1=2.27, 10=2.27, 50=1.98, 100=1.74, 1000=0.975, 10000=0.975 (USD)
R89-R92 = Res1: RES SMD 60.4 OHM 1% 1/10W 0603; Manufacturer: Vishay; Manufacturer Part Number: CRCW060360R4FKEA; Resistance: 60.4R; Power Rating: 100mW; Temperature Coefficient: 100ppm/°C; Voltage Rating: 75V; Published: 8-Jun-2000; LatestRevisionDate: 17-Jul-2002; LatestRevisionNote: Re-released for DXP Platform.; PackageReference: AXIAL-0.3; Publisher: Altium Limited; PackageDescription: Axial Device, Thru-Hole; 2 Leads; 0.3 in Pin Spacing; Supplier 1: Digi-Key; Supplier Part Number 1: 541-60.4HCT-ND; Stock 1: 0; Pricing 1: 1=0.1, 10=0.042, 100=0.017, 1000=0.00764, 2500=0.00663 (USD); Mount: Surface Mount; Case/Package: 0603; Weight: 7.1E-05oz; Contact Plating: Tin; Case Code (Metric): 1608; Case Code (Imperial): 0603; Min Operating Temperature: -55°C; Max Operating Temperature: 155°C; Tolerance: 1%; Packaging: Tape and Reel; Composition: Thick Film; Package Quantity: 10; Number of Terminations: 2; Military Standard: Not; Termination: SMD/SMT; Max Power Dissipation: 100mW; Features: Automotive AEC-Q200; Voltage Rating (DC): 75V; Working Voltage: 75V; Length: 1.55mm; Height: 0.45mm; Width: 0.033inch; Depth: 0.85mm; Radiation Hardening: No; Lead Free: Lead Free; REACH SVHC: Unknown; ComponentLink1URL: http://www.vishay.com/docs/20035/dcrcwe3.pdf; ComponentLink1Description: http://www.vishay.com/docs/20035/dcrcwe3.pdf; ComponentLink2URL: http://uk.rs-online.com/webdocs/0d98/0900766b80d98afc.pdf; ComponentLink2Description: http://uk.rs-online.com/webdocs/0d98/0900766b80d98afc.pdf; ComponentLink3URL: http://www.mouser.com/ds/2/427/dcrcwe3-109170.pdf; ComponentLink3Description: http://www.mouser.com/ds/2/427/dcrcwe3-109170.pdf; ComponentLink4URL: http://www.alliedelec.com/m/d/0c934d6939ccefa68dbe0b96d821c8cf.pdf; ComponentLink4Description: http://www.alliedelec.com/m/d/0c934d6939ccefa68dbe0b96d821c8cf.pdf; ComponentLink5URL: http://www.farnell.com/datasheets/2046716.pdf; ComponentLink5Description: http://www.farnell.com/datasheets/2046716.pdf; ComponentLink6URL: http://www.farnell.com/datasheets/2111203.pdf; ComponentLink6Description: http://www.farnell.com/datasheets/2111203.pdf; Supplier 2: Mouser; Supplier Part Number 2: 71-CRCW0603-60.4-E3; Stock 2: 6319; Pricing 2: 1=0.1, 10=0.044, 50=0.044, 100=0.026, 1000=0.018, 10000=0.006 (USD)
R93 R94 R101 R110 R111 R500 = R-Generic-0402: as R80 on sheet PG10_ MCU; ComponentLink1URL: http://www.yageo.com/documents/recent/PYu-RC_Group_51_RoHS_L_9.pdf; ComponentLink1Description: http://www.yageo.com/documents/recent/PYu-RC_Group_51_RoHS_L_9.pdf; ComponentLink2URL: http://www.mouser.com/ds/2/447/PYu-RC0402_51_RoHS_L_6_r-8721.pdf; ComponentLink2Description: http://www.mouser.com/ds/2/447/PYu-RC0402_51_RoHS_L_6_r-8721.pdf; ComponentLink3URL: http://www.farnell.com/datasheets/1018594.pdf; ComponentLink3Description: http://www.farnell.com/datasheets/1018594.pdf; Supplier 1: Digi-Key; Supplier Part Number 1: 541-2955-1-ND; Stock 1: 17223; Pricing 1: 1=0.15, 10=0.132, 100=0.0508, 1000=0.02236, 2500=0.01931, 5000=0.01728 (USD); Mount: Surface Mount; Case/Package: 0402; Number of Pins: 2; Weight: 2.3E-05oz; Case Code (Metric): 1005; Case Code (Imperial): 0402; Contact Plating: Lead,Tin; Min Operating Temperature: -55°C; Max Operating Temperature: 155°C; Tolerance: 1%; Packaging: Tape and Reel; Package Quantity: 10000; Composition: Thick Film; Number of Terminations: 2; Military Standard: Not; Max Power Dissipation: 63mW; Voltage Rating (DC): 50V; Features: Automotive AEC-Q200; Length: 1mm; Height: 0.016inch; Width: 0.02inch; Depth: 0.5mm; Radiation Hardening: No; Lead Free: Contains Lead; REACH SVHC: Unknown; ComponentLink4URL: http://www.vishay.com/docs/20008/dcrcw.pdf?src-supplier=Digi-Key; ComponentLink4Description: http://www.vishay.com/docs/20008/dcrcw.pdf?src-supplier=Digi-Key; ComponentLink5URL: https://www.verical.com/server-webapp/html/getDatasheet?partID=104182&src-supplier=Verical; ComponentLink5Description: https://www.verical.com/server-webapp/html/getDatasheet?partID=104182&src-supplier=Verical; ComponentLink6URL: http://www.vishay.com/docs/20008/dcrcw.pdf?src-supplier=Avnet; ComponentLink6Description: http://www.vishay.com/docs/20008/dcrcw.pdf?src-supplier=Avnet
R109 = Res1: FERRITE BEAD 600 OHM 0603 1LN; Manufacturer: Wurth Electronics; Manufacturer Part Number: 742792651; Tolerance: 25%; Current Rating: 1A; Impedance: 600R; Number of Lines: 1; DC Resistance (DCR): 200mR; Test Frequency: 100MHz; Inductance: 0.36h; Supplier 1: Digi-Key; Supplier Part Number 1: 732-1593-1-ND; Stock 1: 349001; Pricing 1: 1=0.16, 50=0.1572, 100=0.1451, 500=0.13846, 1000=0.13192 (EUR); Mount: Surface Mount; Case/Package: SMD/SMT; Weight: 0.000141oz; Case Code (Metric): 1608; Case Code (Imperial): 0603; Material: Ferrite; Core Material: Ferrite; Min Operating Temperature: -55°C; Max Operating Temperature: 125°C; Package Quantity: 1; Packaging: Tape and Reel; Max Current Rating: 1A; Max DC Current: 1A; Termination: SMD/SMT; Resistance: 200mR; Length: 1.6mm; Height: 0.8mm; Width: 0.8mm; Depth: 0.8mm; REACH SVHC: Unknown; Lead Free: Lead Free; ComponentLink1URL: http://documents.rs-components.com/techlib://itc_doclist_GB.htm?stockno=6694046; ComponentLink1Description: http://documents.rs-components.com/techlib://itc_doclist_GB.htm?stockno=6694046; ComponentLink2URL: http://www.farnell.com/datasheets/1705833.pdf; ComponentLink2Description: http://www.farnell.com/datasheets/1705833.pdf; ComponentLink3URL: https://katalog.we-online.de/pbs/datasheet/742792651.pdf; ComponentLink3Description: https://katalog.we-online.de/pbs/datasheet/742792651.pdf; ComponentLink4URL: http://www.mouser.com/ds/2/445/742792651-538156.pdf; ComponentLink4Description: http://www.mouser.com/ds/2/445/742792651-538156.pdf
U7 U8 = LTC6102HVHMS8: IC OPAMP CURR SENSE 200KHZ 8MSOP; Manufacturer: Analog Devices / Linear Technology; Manufacturer Part Number: LTC6102HMS8-1#PBF; Number of Channels: 1; Nominal Gain Bandwidth Product: 140kHz; Max Supply Voltage: 60V; Min Supply Voltage: 4V; Input Bias Current: 60pA; Input Offset Voltage (Vos): 3uV; Operating Supply Current: 420uA; Output Current per Channel: 1mA; Power Supply Rejection Ratio (PSRR): 120dB; Supplier 1: Digi-Key; Supplier Part Number 1: LTC6102HMS8-1#PBF-ND; Supplier 2: Mouser; Supplier Part Number 2: 584-LTC6102HMS8-1PBF; Stock 1: 1157; Pricing 1: 1=5.15, 25=3.4204, 100=2.8152 (USD); Case/Package: MSOP; Number of Pins: 8; Min Operating Temperature: -40°C; Max Operating Temperature: 125°C; Package Quantity: 50; Packaging: Rail/Tube; Number of Circuits: 1; Gain Bandwidth Product: 200kHz; Number of Elements: 1; Bandwidth: 200kHz; Lead Free: Lead Free; ComponentLink1URL: http://www.linear.com/docs/44087; ComponentLink1Description: http://www.linear.com/docs/44087
U10 = TSV912IQ2T: IC OPAMP GP 750KHZ RRO 8MSOP; Manufacturer: Analog Devices / Linear Technology; Manufacturer Part Number: LTC6078HMS8#TRPBF; Common Mode Rejection Ratio: 91dB; Slew Rate: 0.05V/µs; Max Supply Voltage: 5.5V; Min Supply Voltage: 2.7V; Number of Circuits: 2; Input Bias Current: 0.2pA; Input Offset Voltage (Vos): 7uV; Operating Supply Current: 55uA; Output Current per Channel: 25mA; Voltage Gain: 125dB; Power Supply Rejection Ratio (PSRR): 120dB; Supplier 1: Digi-Key; Supplier Part Number 1: LTC6078HMS8#TRPBFCT-ND; Stock 1: 1466; Pricing 1: 1=4.05, 25=3.6136, 100=2.5704, 250=2.3562 (USD); Case/Package: MSOP; Number of Pins: 8; Min Operating Temperature: -40°C; Max Operating Temperature: 125°C; Package Quantity: 2500; Unity Gain Bandwidth Product: 750kHz; Nominal Gain Bandwidth Product: 750kHz; Packaging: Tape and Reel; Gain Bandwidth Product: 750kHz; Number of Elements: 2; Number of Channels: 2; Lead Free: Lead Free; ComponentLink1URL: http://www.linear.com/docs/9198; ComponentLink1Description: http://www.linear.com/docs/9198
U11 = AP2210K: IC REG LINEAR 5V 300MA SOT23-5; PART NUMBER: AP2210K-5.0TRG1; Manufacturer: Diodes; Number of Outputs: 1; Min Input Voltage: 2.5V; Max Input Voltage: 13.2V; Dropout Voltage: 250mV; Polarity: Positive; Quiescent Current: 150uA; Accuracy: 1%; Power Supply Rejection Ratio (PSRR): 75dB; Output Type: Fixed; Supplier 1: Digi-Key; Supplier Part Number 1: AP2210K-5.0TRG1DICT-ND; Manufacturer Part Number: AP2210K-5.0TRG1; Stock 1: 28886; Pricing 1: 1=0.43, 10=0.349, 100=0.2373, 500=0.17798, 1000=0.13349 (USD); Mount: Surface Mount; Case/Package: SOT-23-5; Number of Pins: 5; Weight: 0.001058oz; Min Operating Temperature: -40°C; Max Operating Temperature: 125°C; Max Output Current: 300mA; Output Voltage: 5V; Package Quantity: 3000; Packaging: Tape and Reel; Output Current: 300mA; Number of Regulators: 1; Lead Free: Lead Free; ComponentLink1URL: https://www.diodes.com/assets/Datasheets/AP2210.pdf; ComponentLink1Description: https://www.diodes.com/assets/Datasheets/AP2210.pdf
U12 = LTC1865: IC A/D CONV 2CH 16BIT 10-MSOP; Manufacturer: Analog Devices / Linear Technology; Manufacturer Part Number: LTC1865LIMS#PBF; Min Supply Voltage: 4.75V; Max Supply Voltage: 5.25V; Interface: Serial,SPI; Max Power Dissipation: 400mW; Number of Bits: 16; Sampling Rate: 150KS/s; Number of Converters: 1; Resolution: 16b; Polarity: Unipolar; Supply Type: Single; Integral Nonlinearity (INL): 8LSB; Nominal Supply Current: 450uA; Supplier 1: Mouser; Supplier Part Number 1: 584-LTC1865LIMS#PBF; Stock 1: 130; Pricing 1: 1=14.38, 10=13.18, 50=9.53, 100=7.96, 1000=7.96, 10000=7.96 (USD); Mount: Surface Mount; Case/Package: MSOP; Number of Pins: 10; Min Operating Temperature: -40°C; Max Operating Temperature: 85°C; Package Quantity: 50; Packaging: Rail/Tube; Number of Elements: 1; Power Dissipation: 400mW; REACH SVHC: No SVHC; Lead Free: Lead Free; ComponentLink1URL: http://www.farnell.com/datasheets/1575726.pdf; ComponentLink1Description: http://www.farnell.com/datasheets/1575726.pdf; ComponentLink2URL: http://www.linear.com/pc/downloadDocument.do?navId=H0,C1,C1155,C1001,C1158,P2259,D1106; ComponentLink2Description: http://www.linear.com/pc/downloadDocument.do?navId=H0,C1,C1155,C1001,C1158,P2259,D1106; Supplier 2: Digi-Key; Supplier Part Number 2: LTC1865LIMS#PBF-ND; Stock 2: 318; Pricing 2: 1=14.35, 25=9.5292, 100=7.956 (USD)